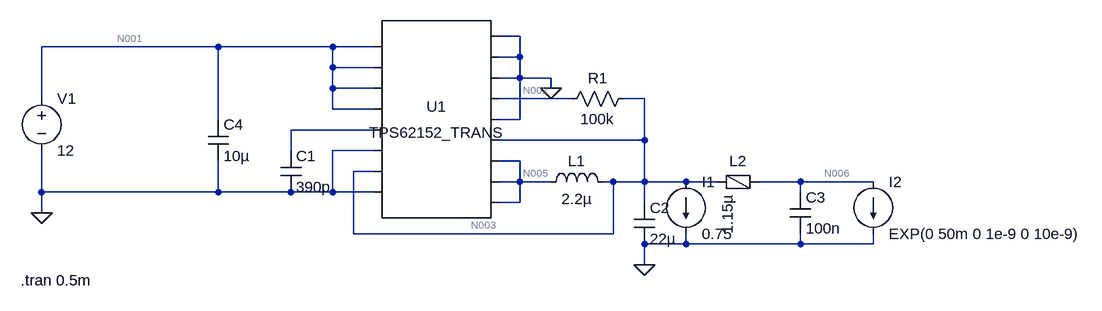
[diagram p0: schematic 3V3Buck.asc]
3V3Buck.asc, the LTspice schematic file:
Version 4
SHEET 1 1624 680
WIRE 736 -704 704 -704
WIRE 272 -688 0 -688
WIRE 448 -688 272 -688
WIRE 512 -688 448 -688
WIRE 736 -672 736 -704
WIRE 736 -672 704 -672
WIRE 448 -656 448 -688
WIRE 512 -656 448 -656
WIRE 736 -640 736 -672
WIRE 736 -640 704 -640
WIRE 784 -640 736 -640
WIRE 448 -624 448 -656
WIRE 512 -624 448 -624
WIRE 784 -624 784 -640
WIRE 0 -608 0 -688
WIRE 816 -608 704 -608
WIRE 928 -608 896 -608
WIRE 448 -592 448 -624
WIRE 512 -592 448 -592
WIRE 272 -576 272 -688
WIRE 736 -576 736 -640
WIRE 736 -576 704 -576
WIRE 512 -560 384 -560
WIRE 928 -544 928 -608
WIRE 928 -544 704 -544
WIRE 384 -528 384 -560
WIRE 512 -528 448 -528
WIRE 736 -512 704 -512
WIRE 512 -496 480 -496
WIRE 736 -480 736 -512
WIRE 736 -480 704 -480
WIRE 784 -480 736 -480
WIRE 880 -480 864 -480
WIRE 928 -480 928 -544
WIRE 928 -480 880 -480
WIRE 992 -480 928 -480
WIRE 1040 -480 992 -480
WIRE 1168 -480 1104 -480
WIRE 1280 -480 1168 -480
WIRE 0 -464 0 -528
WIRE 272 -464 272 -512
WIRE 272 -464 0 -464
WIRE 384 -464 272 -464
WIRE 448 -464 448 -528
WIRE 448 -464 384 -464
WIRE 512 -464 448 -464
WIRE 1168 -464 1168 -480
WIRE 736 -448 736 -480
WIRE 736 -448 704 -448
WIRE 928 -448 928 -480
WIRE 0 -432 0 -464
WIRE 480 -400 480 -496
WIRE 880 -400 880 -480
WIRE 880 -400 480 -400
WIRE 992 -384 992 -400
WIRE 992 -384 928 -384
WIRE 1168 -384 1168 -400
WIRE 1168 -384 992 -384
WIRE 1280 -384 1280 -400
WIRE 1280 -384 1168 -384
WIRE 928 -352 928 -384
FLAG 0 -432 0
FLAG 784 -624 0
FLAG 928 -352 0
SYMBOL AutoGenerated\\TPS62152_TRANS 608 -576 R0
SYMATTR InstName U1
SYMBOL voltage 0 -624 R0
WINDOW 123 0 0 Left 0
WINDOW 39 0 0 Left 0
SYMATTR InstName V1
SYMATTR Value 12
SYMBOL cap 368 -528 R0
SYMATTR InstName C1
SYMATTR Value 390p
SYMBOL ind 768 -464 R270
WINDOW 0 32 56 VTop 2
WINDOW 3 5 56 VBottom 2
SYMATTR InstName L1
SYMATTR Value 2.2µ
SYMBOL cap 912 -448 R0
SYMATTR InstName C2
SYMATTR Value 22µ
SYMBOL res 912 -624 R90
WINDOW 0 0 56 VBottom 2
WINDOW 3 32 56 VTop 2
SYMATTR InstName R1
SYMATTR Value 100k
SYMBOL current 992 -480 R0
WINDOW 123 0 0 Left 0
WINDOW 39 0 0 Left 0
SYMATTR InstName I1
SYMATTR Value 0.75
SYMBOL cap 1152 -464 R0
SYMATTR InstName C3
SYMATTR Value 100n
SYMBOL FerriteBead 1072 -480 R90
WINDOW 0 -16 0 VBottom 2
SYMATTR InstName L2
SYMATTR Value 1.15µ
SYMATTR SpiceLine Ipk=0.1 Rser=0.53 Rpar=760 Cpar=560f mfg="Würth Elektronik" pn="7427927261 WE-CBF 0402"
SYMBOL current 1280 -480 R0
WINDOW 123 0 0 Left 0
WINDOW 39 0 0 Left 0
SYMATTR InstName I2
SYMATTR Value EXP(0 50m 0 1e-9 0 10e-9)
SYMBOL cap 256 -576 R0
SYMATTR InstName C4
SYMATTR Value 10µ
TEXT -32 -328 Left 2 !.tran 0.5m

The netlist it stands for:
* 3V3Buck.asc
* U1: TPS62152_TRANS (symbol AutoGenerated\TPS62152_TRANS not available, pins judged from their places): pin1=N001 pin2=N001 pin3=N001 pin4=N001 pin5=N004 pin6=0 pin7=N003 pin8=0 pin9=0 pin10=0 pin11=0 pin12=N002 pin13=0 pin14=N003 pin15=N005 pin16=N005 pin17=N005
V1 N001 0 12
C1 N004 0 390p
L1 N005 N003 2.2µ
C2 N003 0 22µ
R1 N003 N002 100k
I1 N003 0 0.75
C3 N006 0 100n
L2 N006 N003 1.15µ Ipk=0.1 Rser=0.53 Rpar=760 Cpar=560f mfg="Würth Elektronik" pn="7427927261 WE-CBF 0402"
I2 N006 0 EXP(0 50m 0 1e-9 0 10e-9)
C4 N001 0 10µ
.tran 0.5m
.backanno
.end

* Results of the author's LTspice run, read from the files saved beside the schematic
* Operating Point, zero values left out:
*   V(n003) = -1.01 V
*   V(n001) = 12 V
*   V(n005) = -1.009 V
*   V(n002) = -1.512 mV
*   V(n006) = -1.01 V
*   I(L1) = 750 mA
*   I(I1) = 750 mA
*   I(R1) = -10.08 µA
*   I(V1) = -20.54 µA